# Altium schematic sheet USB - C.SchDoc
size A3; SheetNumber: 9; SheetTotal: 12
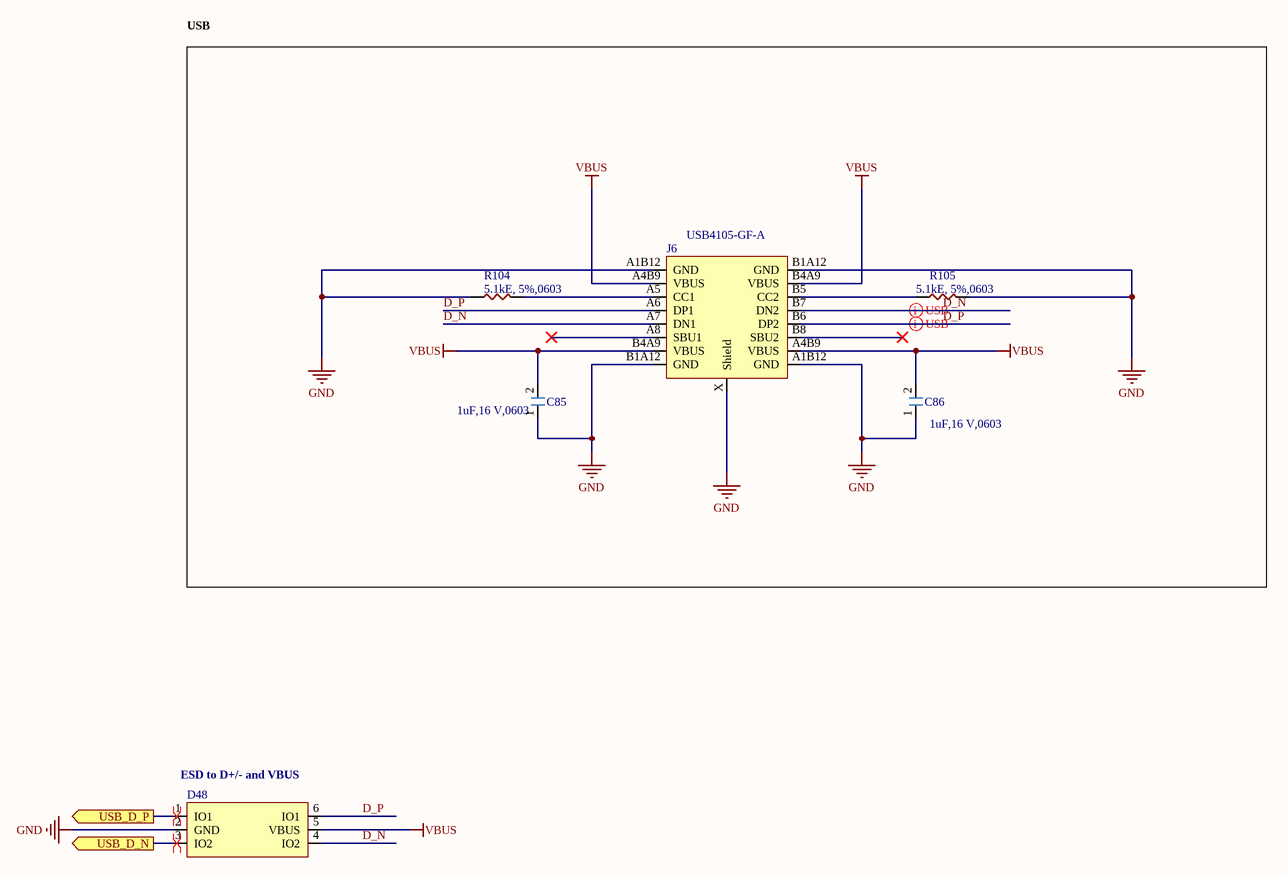
[diagram p0: USB - C.SchDoc]

## Parts
C85  Value Display: 1uF,16 V,0603  [CAPC1608X05N 0603]  (hidden comment: CGA3E1X7R1C105K080AC)
C86  Value Display: 1uF,16 V,0603  [CAPC1608X05N 0603]  (hidden comment: CGA3E1X7R1C105K080AC)
D48  USBLC6-2SC6  [SOT95P280X145-6N]  (value not drawn)
J6  USB4105-GF-A  [Con_USB4105-GF-A]
R104  Value Display: 5.1kE, 5%,0603  [RESC1608X05N 0603]  (hidden comment: CRCW06035K10JNEA)
R105  Value Display: 5.1kE, 5%,0603  [RESC1608X05N 0603]  (hidden comment: CRCW06035K10JNEA)

## Blocks framed on the sheet
USB: C85 C86 J6 R104 R105

## Ports
USB_D_N (out), USB_D_P (out)

## Nets
GND: C85.1 C86.1 D48.2(GND) J6.A1B12(GND) J6.B1A12(GND) J6.X(Shield) R104.1 R105.2
VBUS: C85.2 C86.2 D48.5(VBUS) J6.A4B9(VBUS) J6.B4A9(VBUS)
D_N: D48.4(IO2) J6.A7(DN1) J6.B7(DN2)
D_P: D48.6(IO1) J6.A6(DP1) J6.B6(DP2)
USB_D_N: D48.3(IO2) ; port USB_D_N
USB_D_P: D48.1(IO1) ; port USB_D_P
NetJ6_A5: J6.A5(CC1) R104.2
NetJ6_B5: J6.B5(CC2) R105.1

Not connected (* = marked no-connect by the designer): J6 A8(SBU1)* B8(SBU2)*

## Layout directives
differential pair: D_N, D_P, USB_D_N, USB_D_P

## Notes on the sheet
- (near D48) ESD to D+/- and VBUS

## Library data of the parts
C85 C86 = Cap_CGA3E1X7R1C105K080AC: Multilayer Ceramic Capacitor, 1uF, 16V, ±10%,  X7R 0603 [1608 Metric]; Manufacturer: TDK Corporation; Polarized: No; AEC-Q: 200; Min Temp: -55 degC; Max Temp: 125 degC; Value: 1 uF; Manufacturer Part Number: CGA3E1X7R1C105K080AC; Package: 0603; RoHS: Yes; Mount Type: Surface Mount; Supplier 1: Digikey; Voltage: 16V; Tolerance: 10%; Technology: Ceramic; Value 1: CGA3E1X7R1C105K080AC; Category: Capacitor; ComponentLink1Description: Datasheet; ComponentLink1URL: https://product.tdk.com/system/files/dam/doc/product/capacitor/ceramic/mlcc/catalog/mlcc_automotive_general_en.pdf; Supplier 1 Part Number: 445-12539-1-ND; Supplier 1 pricing per Unit: 10.84 INR; Supplier: Mouser; Supplier Part Number: 810-CGA3E1X7R1C105AC; Supplier pricing per Unit: 10.01 INR; Temp Coefficient: X7R
D48 = Diode_TVS_USBLC6-2SC6: 17V Clamp 5A (8/20µs) Ipp Tvs Diode Surface Mount SOT-23-6; Manufacturer: ST; AEC-Q: NA; Max Temp: 150 degC; Min Temp: -40 degC; Value: 5.25V; Category: TVS Diode; ComponentLink1Description: Datasheet; ComponentLink1URL: https://www.st.com/content/ccc/resource/technical/document/datasheet/06/1d/48/9c/6c/20/4a/b2/CD00050750.pdf/files/CD00050750.pdf/jcr:content/translations/en.CD00050750.pdf; Manufacturer Part Number: USBLC6-2SC6; Mount Type: Surface Mount; Package: SOT 23-6; RoHS: Yes; Supplier 1: Digikey; Supplier 1 Part Number: 497-5235-1-ND; Supplier 1 pricing per Unit: 29.30 INR; Supplier: Mouser; Supplier Part Number: 511-USBLC6-2SC6; Supplier pricing per Unit: 29.19 INR; Value 1: USBLC6-2SC6; Value Display: 5.25V; Voltage: 5.25V
J6 = Con_USB_USB4105-GF-A: USB Type C 2.0 Connector; Manufacturer: GCT; Circuits: 16; No. of Rows: 1; Pitch: 0.5 mm; Value: 16 Pin; Value Display: USB 2.0 Type-C; Category: Connector; ComponentLink1Description: Datasheet; ComponentLink1URL: https://mm.digikey.com/Volume0/opasdata/d220001/medias/docus/5492/USB4105.pdf; Manufacturer Part Number: USB4105-GF-A; Mount Type: Surface Mount; Package: SMT; RoHS: Yes; Supplier 1: Digikey; Supplier 1 Part Number: 2073-USB4105-GF-ACT-ND; Supplier 1 pricing per Unit: 67.8 INR; Supplier: Mouser; Supplier Part Number: 640-USB4105-GF-A; Supplier pricing per Unit: 67.55 INR; Value 1: USB4105-GF-A
R104 R105 = Res_CRCW06035K10JNEA: SMD Chip Resistor, 5.1k Ohm, ± 5%, 250 mW, 0603 [1608 Metric], Thick Film, General Purpose; Manufacturer: Vishay Dale; AEC-Q: 200; Max Temp: 155 degC; Min Temp: -55 degC; Power: 1/10W; Value: 5.1k R; Manufacturer Part Number: CRCW06035K10JNEA; Category: Resistor; ComponentLink1Description: Datasheet; ComponentLink1URL: https://www.vishay.com/docs/20035/dcrcwe3.pdf; Mount Type: Surface Mount; Package: 0603; RoHS: Yes; Supplier 1: Digikey; Supplier 1 Part Number: 541-5.1KGCT-ND; Supplier 1 pricing per Unit: 8.34 INR; Supplier: Mouser; Supplier Part Number: 71-CRCW0603J-5.1K-E3; Supplier pricing per Unit: 8.34 INR; Tolerance: 5%; Value 1: CRCW06035K10JNEA